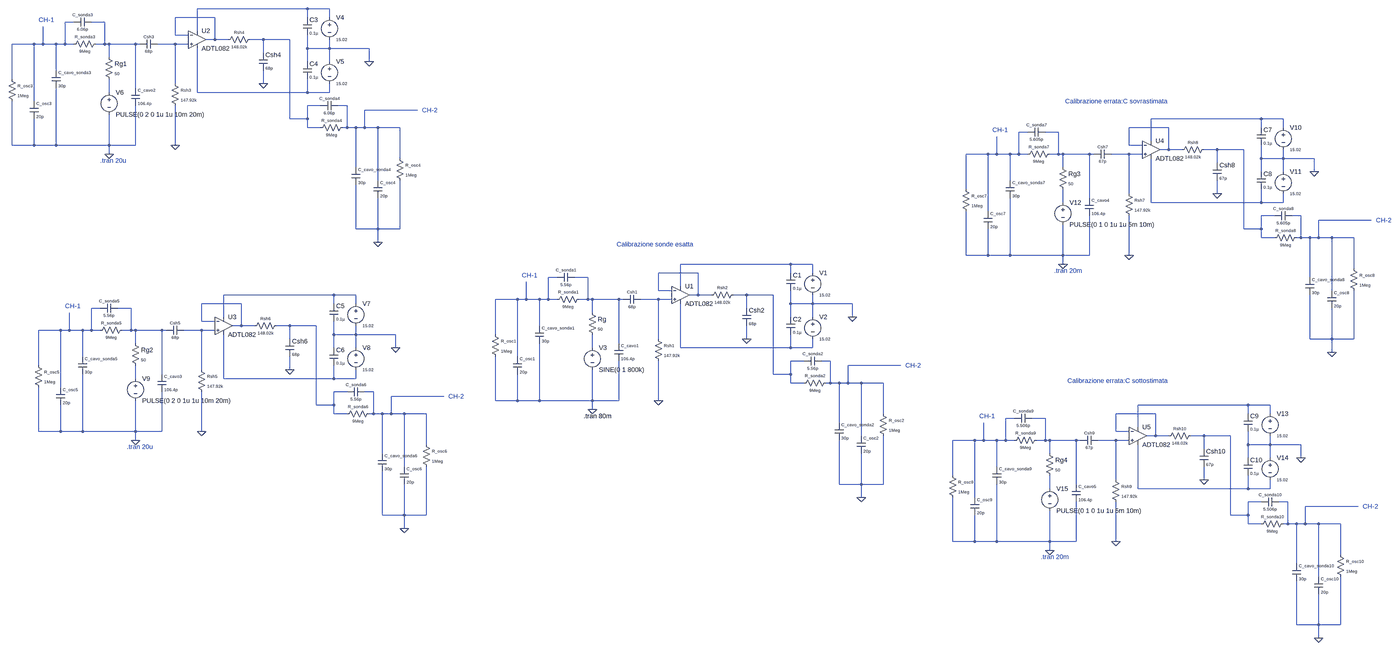
[diagram p0: schematic Shaper_Basic.asc, whole sheet]
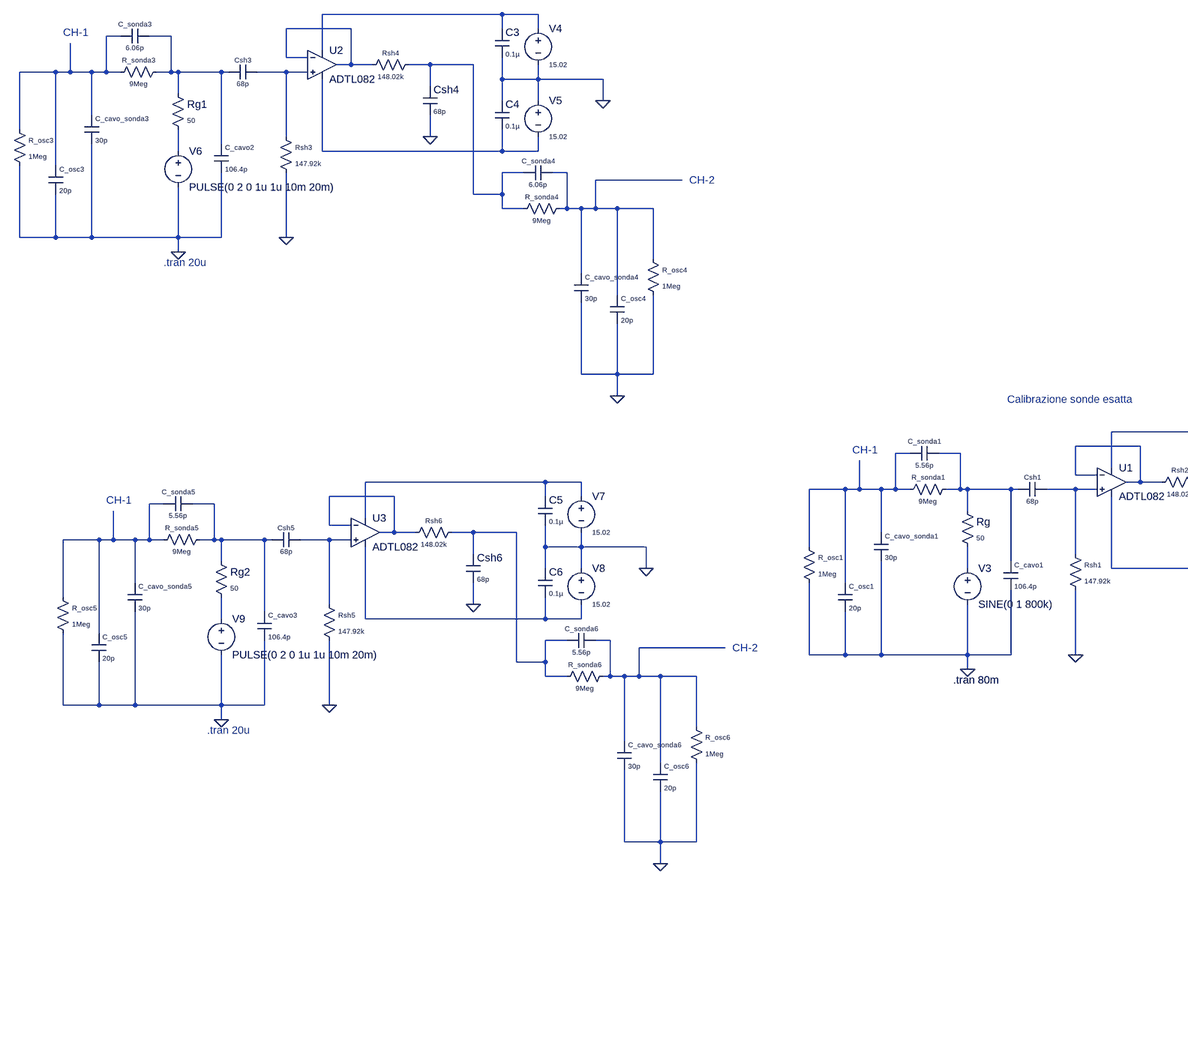
[diagram p1: schematic Shaper_Basic.asc, part, row 1 of 1, column 1 of 2]
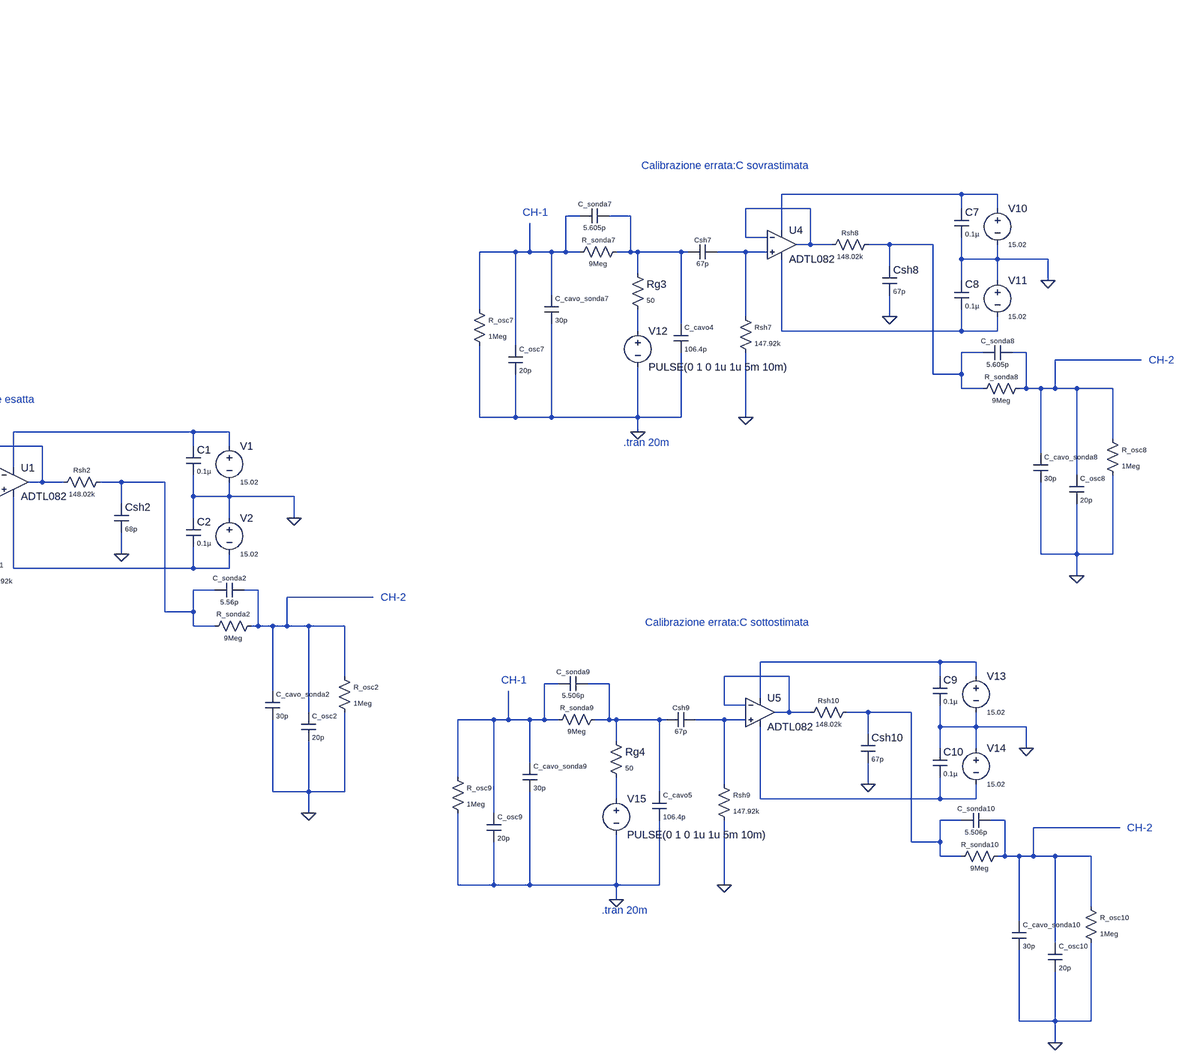
[diagram p2: schematic Shaper_Basic.asc, part, row 1 of 1, column 2 of 2]
Shaper_Basic.asc, the LTspice schematic file:
Version 4.1
SHEET 1 4492 1780
WIRE -1712 -1024 -2112 -1024
WIRE -1632 -1024 -1712 -1024
WIRE -2048 -992 -2192 -992
WIRE -1712 -992 -1712 -1024
WIRE -1632 -992 -1632 -1024
WIRE -2560 -976 -2592 -976
WIRE -2448 -976 -2496 -976
WIRE -2112 -944 -2112 -1024
WIRE -2192 -928 -2192 -992
WIRE -2144 -928 -2192 -928
WIRE -2048 -912 -2048 -992
WIRE -2048 -912 -2080 -912
WIRE -2000 -912 -2048 -912
WIRE -1872 -912 -1920 -912
WIRE -1776 -912 -1872 -912
WIRE -2704 -896 -2784 -896
WIRE -2672 -896 -2672 -960
WIRE -2672 -896 -2704 -896
WIRE -2624 -896 -2672 -896
WIRE -2592 -896 -2592 -976
WIRE -2592 -896 -2624 -896
WIRE -2560 -896 -2592 -896
WIRE -2448 -896 -2448 -976
WIRE -2448 -896 -2480 -896
WIRE -2432 -896 -2448 -896
WIRE -2336 -896 -2432 -896
WIRE -2320 -896 -2336 -896
WIRE -2192 -896 -2256 -896
WIRE -2144 -896 -2192 -896
WIRE -1712 -880 -1712 -928
WIRE -1632 -880 -1632 -912
WIRE -1632 -880 -1712 -880
WIRE -1488 -880 -1632 -880
WIRE -1872 -864 -1872 -912
WIRE -2432 -848 -2432 -896
WIRE -1712 -832 -1712 -880
WIRE -1632 -832 -1632 -880
WIRE -1488 -832 -1488 -880
WIRE -2624 -800 -2624 -896
WIRE -2784 -768 -2784 -896
WIRE -2192 -752 -2192 -896
WIRE -1872 -752 -1872 -800
WIRE -2336 -736 -2336 -896
WIRE -2432 -720 -2432 -768
WIRE -2112 -720 -2112 -880
WIRE -1712 -720 -1712 -768
WIRE -1712 -720 -2112 -720
WIRE -1632 -720 -1632 -752
WIRE -1632 -720 -1712 -720
WIRE -2704 -688 -2704 -896
WIRE -1664 -672 -1712 -672
WIRE -1568 -672 -1600 -672
WIRE -1312 -656 -1504 -656
WIRE -1776 -624 -1776 -912
WIRE -1712 -624 -1712 -672
WIRE -1712 -624 -1776 -624
WIRE 2336 -624 1936 -624
WIRE 2416 -624 2336 -624
WIRE -1712 -592 -1712 -624
WIRE -1664 -592 -1712 -592
WIRE -1568 -592 -1568 -672
WIRE -1568 -592 -1584 -592
WIRE -1536 -592 -1568 -592
WIRE -1504 -592 -1504 -656
WIRE -1504 -592 -1536 -592
WIRE -1456 -592 -1504 -592
WIRE -1376 -592 -1456 -592
WIRE 2000 -592 1856 -592
WIRE 2336 -592 2336 -624
WIRE 2416 -592 2416 -624
WIRE 1488 -576 1456 -576
WIRE 1600 -576 1552 -576
WIRE 1936 -544 1936 -624
WIRE -2784 -528 -2784 -688
WIRE -2704 -528 -2704 -624
WIRE -2704 -528 -2784 -528
WIRE -2624 -528 -2624 -736
WIRE -2624 -528 -2704 -528
WIRE -2432 -528 -2432 -640
WIRE -2432 -528 -2624 -528
WIRE -2336 -528 -2336 -672
WIRE -2336 -528 -2432 -528
WIRE -2192 -528 -2192 -672
WIRE 1856 -528 1856 -592
WIRE 1904 -528 1856 -528
WIRE 2000 -512 2000 -592
WIRE 2000 -512 1968 -512
WIRE 2048 -512 2000 -512
WIRE 2176 -512 2128 -512
WIRE 2272 -512 2176 -512
WIRE -2432 -496 -2432 -528
WIRE 1344 -496 1264 -496
WIRE 1376 -496 1376 -560
WIRE 1376 -496 1344 -496
WIRE 1424 -496 1376 -496
WIRE 1456 -496 1456 -576
WIRE 1456 -496 1424 -496
WIRE 1488 -496 1456 -496
WIRE 1600 -496 1600 -576
WIRE 1600 -496 1568 -496
WIRE 1616 -496 1600 -496
WIRE 1712 -496 1616 -496
WIRE 1728 -496 1712 -496
WIRE 1856 -496 1792 -496
WIRE 1904 -496 1856 -496
WIRE -1376 -480 -1376 -592
WIRE 2336 -480 2336 -528
WIRE 2416 -480 2416 -512
WIRE 2416 -480 2336 -480
WIRE 2528 -480 2416 -480
WIRE 2176 -464 2176 -512
WIRE -1536 -448 -1536 -592
WIRE 1616 -448 1616 -496
WIRE 2336 -432 2336 -480
WIRE 2416 -432 2416 -480
WIRE 2528 -432 2528 -480
WIRE -1456 -400 -1456 -592
WIRE 1424 -400 1424 -496
WIRE 1264 -368 1264 -496
WIRE 1856 -352 1856 -496
WIRE 2176 -352 2176 -400
WIRE 1712 -336 1712 -496
WIRE 1616 -320 1616 -368
WIRE 1936 -320 1936 -480
WIRE 2336 -320 2336 -368
WIRE 2336 -320 1936 -320
WIRE 2416 -320 2416 -352
WIRE 2416 -320 2336 -320
WIRE 1344 -288 1344 -496
WIRE 2384 -272 2336 -272
WIRE 2480 -272 2448 -272
WIRE 2736 -256 2544 -256
WIRE -1536 -224 -1536 -384
WIRE -1456 -224 -1456 -336
WIRE -1456 -224 -1536 -224
WIRE -1376 -224 -1376 -400
WIRE -1376 -224 -1456 -224
WIRE 2272 -224 2272 -512
WIRE 2336 -224 2336 -272
WIRE 2336 -224 2272 -224
WIRE 2336 -192 2336 -224
WIRE 2384 -192 2336 -192
WIRE 2480 -192 2480 -272
WIRE 2480 -192 2464 -192
WIRE 2512 -192 2480 -192
WIRE 2544 -192 2544 -256
WIRE 2544 -192 2512 -192
WIRE 2592 -192 2544 -192
WIRE 2672 -192 2592 -192
WIRE -1456 -176 -1456 -224
WIRE 1264 -128 1264 -288
WIRE 1344 -128 1344 -224
WIRE 1344 -128 1264 -128
WIRE 1424 -128 1424 -336
WIRE 1424 -128 1344 -128
WIRE 1616 -128 1616 -240
WIRE 1616 -128 1424 -128
WIRE 1712 -128 1712 -272
WIRE 1712 -128 1616 -128
WIRE 1856 -128 1856 -272
WIRE 416 -96 16 -96
WIRE 496 -96 416 -96
WIRE 1616 -96 1616 -128
WIRE 2672 -80 2672 -192
WIRE 80 -64 -64 -64
WIRE 416 -64 416 -96
WIRE 496 -64 496 -96
WIRE -432 -48 -464 -48
WIRE -320 -48 -368 -48
WIRE 2512 -48 2512 -192
WIRE 16 -16 16 -96
WIRE -64 0 -64 -64
WIRE -16 0 -64 0
WIRE 2592 0 2592 -192
WIRE -1616 16 -2016 16
WIRE -1536 16 -1616 16
WIRE 80 16 80 -64
WIRE 80 16 48 16
WIRE 128 16 80 16
WIRE 256 16 208 16
WIRE 352 16 256 16
WIRE -576 32 -656 32
WIRE -544 32 -544 -32
WIRE -544 32 -576 32
WIRE -496 32 -544 32
WIRE -464 32 -464 -48
WIRE -464 32 -496 32
WIRE -432 32 -464 32
WIRE -320 32 -320 -48
WIRE -320 32 -352 32
WIRE -304 32 -320 32
WIRE -208 32 -304 32
WIRE -192 32 -208 32
WIRE -64 32 -128 32
WIRE -16 32 -64 32
WIRE -1952 48 -2096 48
WIRE -1616 48 -1616 16
WIRE -1536 48 -1536 16
WIRE 416 48 416 0
WIRE 496 48 496 16
WIRE 496 48 416 48
WIRE 640 48 496 48
WIRE -2464 64 -2496 64
WIRE -2352 64 -2400 64
WIRE 256 64 256 16
WIRE -304 80 -304 32
WIRE -2016 96 -2016 16
WIRE 416 96 416 48
WIRE 496 96 496 48
WIRE 640 96 640 48
WIRE -2096 112 -2096 48
WIRE -2048 112 -2096 112
WIRE -1952 128 -1952 48
WIRE -1952 128 -1984 128
WIRE -1904 128 -1952 128
WIRE -1776 128 -1824 128
WIRE -1680 128 -1776 128
WIRE -496 128 -496 32
WIRE -2608 144 -2688 144
WIRE -2576 144 -2576 80
WIRE -2576 144 -2608 144
WIRE -2528 144 -2576 144
WIRE -2496 144 -2496 64
WIRE -2496 144 -2528 144
WIRE -2464 144 -2496 144
WIRE -2352 144 -2352 64
WIRE -2352 144 -2384 144
WIRE -2336 144 -2352 144
WIRE -2240 144 -2336 144
WIRE -2224 144 -2240 144
WIRE -2096 144 -2160 144
WIRE -2048 144 -2096 144
WIRE -1616 160 -1616 112
WIRE -1536 160 -1536 128
WIRE -1536 160 -1616 160
WIRE -1392 160 -1536 160
WIRE -656 160 -656 32
WIRE -1776 176 -1776 128
WIRE -64 176 -64 32
WIRE 256 176 256 128
WIRE 2512 176 2512 16
WIRE 2592 176 2592 64
WIRE 2592 176 2512 176
WIRE 2672 176 2672 0
WIRE 2672 176 2592 176
WIRE -2336 192 -2336 144
WIRE -208 192 -208 32
WIRE -1616 208 -1616 160
WIRE -1536 208 -1536 160
WIRE -1392 208 -1392 160
WIRE -304 208 -304 160
WIRE 16 208 16 48
WIRE 416 208 416 160
WIRE 416 208 16 208
WIRE 496 208 496 176
WIRE 496 208 416 208
WIRE 2592 224 2592 176
WIRE -2528 240 -2528 144
WIRE -576 240 -576 32
WIRE 464 256 416 256
WIRE 560 256 528 256
WIRE -2688 272 -2688 144
WIRE 816 272 624 272
WIRE -2096 288 -2096 144
WIRE -1776 288 -1776 240
WIRE -2240 304 -2240 144
WIRE 352 304 352 16
WIRE 416 304 416 256
WIRE 416 304 352 304
WIRE -2336 320 -2336 272
WIRE -2016 320 -2016 160
WIRE -1616 320 -1616 272
WIRE -1616 320 -2016 320
WIRE -1536 320 -1536 288
WIRE -1536 320 -1616 320
WIRE 416 336 416 304
WIRE 464 336 416 336
WIRE 560 336 560 256
WIRE 560 336 544 336
WIRE 592 336 560 336
WIRE 624 336 624 272
WIRE 624 336 592 336
WIRE 672 336 624 336
WIRE 752 336 672 336
WIRE -2608 352 -2608 144
WIRE -1568 368 -1616 368
WIRE -1472 368 -1504 368
WIRE -1216 384 -1408 384
WIRE -656 400 -656 240
WIRE -576 400 -576 304
WIRE -576 400 -656 400
WIRE -496 400 -496 192
WIRE -496 400 -576 400
WIRE -304 400 -304 288
WIRE -304 400 -496 400
WIRE -208 400 -208 256
WIRE -208 400 -304 400
WIRE -64 400 -64 256
WIRE -1680 416 -1680 128
WIRE -1616 416 -1616 368
WIRE -1616 416 -1680 416
WIRE 2288 416 1888 416
WIRE 2368 416 2288 416
WIRE -304 432 -304 400
WIRE -1616 448 -1616 416
WIRE -1568 448 -1616 448
WIRE -1472 448 -1472 368
WIRE -1472 448 -1488 448
WIRE -1440 448 -1472 448
WIRE -1408 448 -1408 384
WIRE -1408 448 -1440 448
WIRE -1360 448 -1408 448
WIRE -1280 448 -1360 448
WIRE 752 448 752 336
WIRE 1952 448 1808 448
WIRE 2288 448 2288 416
WIRE 2368 448 2368 416
WIRE 1440 464 1408 464
WIRE 1552 464 1504 464
WIRE 592 480 592 336
WIRE 1888 496 1888 416
WIRE -2688 512 -2688 352
WIRE -2608 512 -2608 416
WIRE -2608 512 -2688 512
WIRE -2528 512 -2528 304
WIRE -2528 512 -2608 512
WIRE -2336 512 -2336 400
WIRE -2336 512 -2528 512
WIRE -2240 512 -2240 368
WIRE -2240 512 -2336 512
WIRE -2096 512 -2096 368
WIRE 1808 512 1808 448
WIRE 1856 512 1808 512
WIRE 672 528 672 336
WIRE 1952 528 1952 448
WIRE 1952 528 1920 528
WIRE 2000 528 1952 528
WIRE 2128 528 2080 528
WIRE 2224 528 2128 528
WIRE -2336 544 -2336 512
WIRE 1296 544 1216 544
WIRE 1328 544 1328 480
WIRE 1328 544 1296 544
WIRE 1376 544 1328 544
WIRE 1408 544 1408 464
WIRE 1408 544 1376 544
WIRE 1440 544 1408 544
WIRE 1552 544 1552 464
WIRE 1552 544 1520 544
WIRE 1568 544 1552 544
WIRE 1664 544 1568 544
WIRE 1680 544 1664 544
WIRE 1808 544 1744 544
WIRE 1856 544 1808 544
WIRE -1280 560 -1280 448
WIRE 2288 560 2288 512
WIRE 2368 560 2368 528
WIRE 2368 560 2288 560
WIRE 2480 560 2368 560
WIRE 2128 576 2128 528
WIRE -1440 592 -1440 448
WIRE 1568 592 1568 544
WIRE 2288 608 2288 560
WIRE 2368 608 2368 560
WIRE 2480 608 2480 560
WIRE -1360 640 -1360 448
WIRE 1376 640 1376 544
WIRE 1216 672 1216 544
WIRE 1808 688 1808 544
WIRE 2128 688 2128 640
WIRE 592 704 592 544
WIRE 672 704 672 592
WIRE 672 704 592 704
WIRE 752 704 752 528
WIRE 752 704 672 704
WIRE 1664 704 1664 544
WIRE 1568 720 1568 672
WIRE 1888 720 1888 560
WIRE 2288 720 2288 672
WIRE 2288 720 1888 720
WIRE 2368 720 2368 688
WIRE 2368 720 2288 720
WIRE 672 752 672 704
WIRE 1296 752 1296 544
WIRE 2336 768 2288 768
WIRE 2432 768 2400 768
WIRE 2688 784 2496 784
WIRE -1440 816 -1440 656
WIRE -1360 816 -1360 704
WIRE -1360 816 -1440 816
WIRE -1280 816 -1280 640
WIRE -1280 816 -1360 816
WIRE 2224 816 2224 528
WIRE 2288 816 2288 768
WIRE 2288 816 2224 816
WIRE 2288 848 2288 816
WIRE 2336 848 2288 848
WIRE 2432 848 2432 768
WIRE 2432 848 2416 848
WIRE 2464 848 2432 848
WIRE 2496 848 2496 784
WIRE 2496 848 2464 848
WIRE 2544 848 2496 848
WIRE 2624 848 2544 848
WIRE -1360 864 -1360 816
WIRE 1216 912 1216 752
WIRE 1296 912 1296 816
WIRE 1296 912 1216 912
WIRE 1376 912 1376 704
WIRE 1376 912 1296 912
WIRE 1568 912 1568 800
WIRE 1568 912 1376 912
WIRE 1664 912 1664 768
WIRE 1664 912 1568 912
WIRE 1808 912 1808 768
WIRE 1568 944 1568 912
WIRE 2624 960 2624 848
WIRE 2464 992 2464 848
WIRE 2544 1040 2544 848
WIRE 2464 1216 2464 1056
WIRE 2544 1216 2544 1104
WIRE 2544 1216 2464 1216
WIRE 2624 1216 2624 1040
WIRE 2624 1216 2544 1216
WIRE 2544 1264 2544 1216
FLAG -304 432 0
FLAG 672 752 0
FLAG -64 400 0
FLAG 640 96 0
FLAG 256 176 0
FLAG 1616 -96 0
FLAG 2592 224 0
FLAG 1856 -128 0
FLAG 2528 -432 0
FLAG 2176 -352 0
FLAG 1568 944 0
FLAG 2544 1264 0
FLAG 1808 912 0
FLAG 2480 608 0
FLAG 2128 688 0
FLAG -2432 -496 0
FLAG -1456 -176 0
FLAG -2192 -528 0
FLAG -1488 -832 0
FLAG -1872 -752 0
FLAG -2336 544 0
FLAG -1360 864 0
FLAG -2096 512 0
FLAG -1392 208 0
FLAG -1776 288 0
SYMBOL OpAmps\\ADTL082 16 -48 R0
SYMATTR InstName U1
SYMBOL voltage 496 -80 R0
WINDOW 3 24 96 Left 1
WINDOW 123 0 0 Left 0
WINDOW 39 0 0 Left 0
SYMATTR Value 15.02
SYMATTR InstName V1
SYMBOL voltage 496 80 R0
WINDOW 3 24 96 Left 1
WINDOW 123 0 0 Left 0
WINDOW 39 0 0 Left 0
SYMATTR Value 15.02
SYMATTR InstName V2
SYMBOL cap 400 -64 R0
WINDOW 3 24 56 Left 1
SYMATTR Value 0.1µ
SYMATTR InstName C1
SYMBOL cap 400 96 R0
WINDOW 3 24 56 Left 1
SYMATTR Value 0.1µ
SYMATTR InstName C2
SYMBOL voltage -304 192 R0
WINDOW 123 0 0 Left 0
WINDOW 39 0 0 Left 0
SYMATTR InstName V3
SYMATTR Value SINE(0 1 800k)
SYMBOL res -320 64 R0
WINDOW 3 36 76 Left 1
SYMATTR Value 50
SYMATTR InstName Rg
SYMBOL res -336 16 R90
WINDOW 0 0 56 VBottom 1
WINDOW 3 32 56 VTop 1
SYMATTR InstName R_sonda1
SYMATTR Value 9Meg
SYMBOL cap -368 -64 R90
WINDOW 0 0 32 VBottom 1
WINDOW 3 32 32 VTop 1
SYMATTR InstName C_sonda1
SYMATTR Value 5.56p
SYMBOL res -672 144 R0
WINDOW 0 36 40 Left 1
WINDOW 3 36 76 Left 1
SYMATTR InstName R_osc1
SYMATTR Value 1Meg
SYMBOL cap -592 240 R0
WINDOW 0 24 8 Left 1
WINDOW 3 24 56 Left 1
SYMATTR InstName C_osc1
SYMATTR Value 20p
SYMBOL cap -512 128 R0
WINDOW 0 24 8 Left 1
WINDOW 3 24 56 Left 1
SYMATTR InstName C_cavo_sonda1
SYMATTR Value 30p
SYMBOL res 560 320 R90
WINDOW 0 0 56 VBottom 1
WINDOW 3 32 56 VTop 1
SYMATTR InstName R_sonda2
SYMATTR Value 9Meg
SYMBOL cap 528 240 R90
WINDOW 0 0 32 VBottom 1
WINDOW 3 32 32 VTop 1
SYMATTR InstName C_sonda2
SYMATTR Value 5.56p
SYMBOL cap 576 480 R0
WINDOW 0 24 8 Left 1
WINDOW 3 24 56 Left 1
SYMATTR InstName C_cavo_sonda2
SYMATTR Value 30p
SYMBOL cap 656 528 R0
WINDOW 0 24 8 Left 1
WINDOW 3 24 56 Left 1
SYMATTR InstName C_osc2
SYMATTR Value 20p
SYMBOL res 736 432 R0
WINDOW 0 36 40 Left 1
WINDOW 3 36 76 Left 1
SYMATTR InstName R_osc2
SYMATTR Value 1Meg
SYMBOL cap -224 256 M180
WINDOW 0 24 56 Left 1
WINDOW 3 24 8 Left 1
SYMATTR InstName C_cavo1
SYMATTR Value 106.4p
SYMBOL res -80 160 R0
WINDOW 0 36 40 Left 1
WINDOW 3 36 76 Left 1
SYMATTR InstName Rsh1
SYMATTR Value 147.92k
SYMBOL cap -128 16 R90
WINDOW 0 0 32 VBottom 1
WINDOW 3 32 32 VTop 1
SYMATTR InstName Csh1
SYMATTR Value 68p
SYMBOL res 224 0 R90
WINDOW 0 0 56 VBottom 1
WINDOW 3 32 56 VTop 1
SYMATTR InstName Rsh2
SYMATTR Value 148.02k
SYMBOL cap 240 64 R0
WINDOW 3 24 56 Left 1
SYMATTR Value 68p
SYMATTR InstName Csh2
SYMBOL OpAmps\\ADTL082 1936 -576 R0
SYMATTR InstName U4
SYMBOL voltage 2416 -608 R0
WINDOW 3 24 96 Left 1
WINDOW 123 0 0 Left 0
WINDOW 39 0 0 Left 0
SYMATTR Value 15.02
SYMATTR InstName V10
SYMBOL voltage 2416 -448 R0
WINDOW 3 24 96 Left 1
WINDOW 123 0 0 Left 0
WINDOW 39 0 0 Left 0
SYMATTR Value 15.02
SYMATTR InstName V11
SYMBOL cap 2320 -592 R0
WINDOW 3 24 56 Left 1
SYMATTR Value 0.1µ
SYMATTR InstName C7
SYMBOL cap 2320 -432 R0
WINDOW 3 24 56 Left 1
SYMATTR Value 0.1µ
SYMATTR InstName C8
SYMBOL voltage 1616 -336 R0
WINDOW 123 0 0 Left 0
WINDOW 39 0 0 Left 0
SYMATTR InstName V12
SYMATTR Value PULSE(0 1 0 1u 1u 5m 10m)
SYMBOL res 1600 -464 R0
WINDOW 3 36 76 Left 1
SYMATTR Value 50
SYMATTR InstName Rg3
SYMBOL res 1584 -512 R90
WINDOW 0 0 56 VBottom 1
WINDOW 3 32 56 VTop 1
SYMATTR InstName R_sonda7
SYMATTR Value 9Meg
SYMBOL cap 1552 -592 R90
WINDOW 0 0 32 VBottom 1
WINDOW 3 32 32 VTop 1
SYMATTR InstName C_sonda7
SYMATTR Value 5.605p
SYMBOL res 1248 -384 R0
WINDOW 0 36 40 Left 1
WINDOW 3 36 76 Left 1
SYMATTR InstName R_osc7
SYMATTR Value 1Meg
SYMBOL cap 1328 -288 R0
WINDOW 0 24 8 Left 1
WINDOW 3 24 56 Left 1
SYMATTR InstName C_osc7
SYMATTR Value 20p
SYMBOL cap 1408 -400 R0
WINDOW 0 24 8 Left 1
WINDOW 3 24 56 Left 1
SYMATTR InstName C_cavo_sonda7
SYMATTR Value 30p
SYMBOL res 2480 -208 R90
WINDOW 0 0 56 VBottom 1
WINDOW 3 32 56 VTop 1
SYMATTR InstName R_sonda8
SYMATTR Value 9Meg
SYMBOL cap 2448 -288 R90
WINDOW 0 0 32 VBottom 1
WINDOW 3 32 32 VTop 1
SYMATTR InstName C_sonda8
SYMATTR Value 5.605p
SYMBOL cap 2496 -48 R0
WINDOW 0 24 8 Left 1
WINDOW 3 24 56 Left 1
SYMATTR InstName C_cavo_sonda8
SYMATTR Value 30p
SYMBOL cap 2576 0 R0
WINDOW 0 24 8 Left 1
WINDOW 3 24 56 Left 1
SYMATTR InstName C_osc8
SYMATTR Value 20p
SYMBOL res 2656 -96 R0
WINDOW 0 36 40 Left 1
WINDOW 3 36 76 Left 1
SYMATTR InstName R_osc8
SYMATTR Value 1Meg
SYMBOL cap 1696 -272 M180
WINDOW 0 24 56 Left 1
WINDOW 3 24 8 Left 1
SYMATTR InstName C_cavo4
SYMATTR Value 106.4p
SYMBOL res 1840 -368 R0
WINDOW 0 36 40 Left 1
WINDOW 3 36 76 Left 1
SYMATTR InstName Rsh7
SYMATTR Value 147.92k
SYMBOL cap 1792 -512 R90
WINDOW 0 0 32 VBottom 1
WINDOW 3 32 32 VTop 1
SYMATTR InstName Csh7
SYMATTR Value 67p
SYMBOL res 2144 -528 R90
WINDOW 0 0 56 VBottom 1
WINDOW 3 32 56 VTop 1
SYMATTR InstName Rsh8
SYMATTR Value 148.02k
SYMBOL cap 2160 -464 R0
WINDOW 3 24 56 Left 1
SYMATTR Value 67p
SYMATTR InstName Csh8
SYMBOL OpAmps\\ADTL082 1888 464 R0
SYMATTR InstName U5
SYMBOL voltage 2368 432 R0
WINDOW 3 24 96 Left 1
WINDOW 123 0 0 Left 0
WINDOW 39 0 0 Left 0
SYMATTR Value 15.02
SYMATTR InstName V13
SYMBOL voltage 2368 592 R0
WINDOW 3 24 96 Left 1
WINDOW 123 0 0 Left 0
WINDOW 39 0 0 Left 0
SYMATTR Value 15.02
SYMATTR InstName V14
SYMBOL cap 2272 448 R0
WINDOW 3 24 56 Left 1
SYMATTR Value 0.1µ
SYMATTR InstName C9
SYMBOL cap 2272 608 R0
WINDOW 3 24 56 Left 1
SYMATTR Value 0.1µ
SYMATTR InstName C10
SYMBOL voltage 1568 704 R0
WINDOW 123 0 0 Left 0
WINDOW 39 0 0 Left 0
SYMATTR InstName V15
SYMATTR Value PULSE(0 1 0 1u 1u 5m 10m)
SYMBOL res 1552 576 R0
WINDOW 3 36 76 Left 1
SYMATTR Value 50
SYMATTR InstName Rg4
SYMBOL res 1536 528 R90
WINDOW 0 0 56 VBottom 1
WINDOW 3 32 56 VTop 1
SYMATTR InstName R_sonda9
SYMATTR Value 9Meg
SYMBOL cap 1504 448 R90
WINDOW 0 0 32 VBottom 1
WINDOW 3 32 32 VTop 1
SYMATTR InstName C_sonda9
SYMATTR Value 5.506p
SYMBOL res 1200 656 R0
WINDOW 0 36 40 Left 1
WINDOW 3 36 76 Left 1
SYMATTR InstName R_osc9
SYMATTR Value 1Meg
SYMBOL cap 1280 752 R0
WINDOW 0 24 8 Left 1
WINDOW 3 24 56 Left 1
SYMATTR InstName C_osc9
SYMATTR Value 20p
SYMBOL cap 1360 640 R0
WINDOW 0 24 8 Left 1
WINDOW 3 24 56 Left 1
SYMATTR InstName C_cavo_sonda9
SYMATTR Value 30p
SYMBOL res 2432 832 R90
WINDOW 0 0 56 VBottom 1
WINDOW 3 32 56 VTop 1
SYMATTR InstName R_sonda10
SYMATTR Value 9Meg
SYMBOL cap 2400 752 R90
WINDOW 0 0 32 VBottom 1
WINDOW 3 32 32 VTop 1
SYMATTR InstName C_sonda10
SYMATTR Value 5.506p
SYMBOL cap 2448 992 R0
WINDOW 0 24 8 Left 1
WINDOW 3 24 56 Left 1
SYMATTR InstName C_cavo_sonda10
SYMATTR Value 30p
SYMBOL cap 2528 1040 R0
WINDOW 0 24 8 Left 1
WINDOW 3 24 56 Left 1
SYMATTR InstName C_osc10
SYMATTR Value 20p
SYMBOL res 2608 944 R0
WINDOW 0 36 40 Left 1
WINDOW 3 36 76 Left 1
SYMATTR InstName R_osc10
SYMATTR Value 1Meg
SYMBOL cap 1648 768 M180
WINDOW 0 24 56 Left 1
WINDOW 3 24 8 Left 1
SYMATTR InstName C_cavo5
SYMATTR Value 106.4p
SYMBOL res 1792 672 R0
WINDOW 0 36 40 Left 1
WINDOW 3 36 76 Left 1
SYMATTR InstName Rsh9
SYMATTR Value 147.92k
SYMBOL cap 1744 528 R90
WINDOW 0 0 32 VBottom 1
WINDOW 3 32 32 VTop 1
SYMATTR InstName Csh9
SYMATTR Value 67p
SYMBOL res 2096 512 R90
WINDOW 0 0 56 VBottom 1
WINDOW 3 32 56 VTop 1
SYMATTR InstName Rsh10
SYMATTR Value 148.02k
SYMBOL cap 2112 576 R0
WINDOW 3 24 56 Left 1
SYMATTR Value 67p
SYMATTR InstName Csh10
SYMBOL OpAmps\\ADTL082 -2112 -976 R0
SYMATTR InstName U2
SYMBOL voltage -1632 -1008 R0
WINDOW 3 24 96 Left 1
WINDOW 123 0 0 Left 0
WINDOW 39 0 0 Left 0
SYMATTR Value 15.02
SYMATTR InstName V4
SYMBOL voltage -1632 -848 R0
WINDOW 3 24 96 Left 1
WINDOW 123 0 0 Left 0
WINDOW 39 0 0 Left 0
SYMATTR Value 15.02
SYMATTR InstName V5
SYMBOL cap -1728 -992 R0
WINDOW 3 24 56 Left 1
SYMATTR Value 0.1µ
SYMATTR InstName C3
SYMBOL cap -1728 -832 R0
WINDOW 3 24 56 Left 1
SYMATTR Value 0.1µ
SYMATTR InstName C4
SYMBOL voltage -2432 -736 R0
WINDOW 123 0 0 Left 0
WINDOW 39 0 0 Left 0
SYMATTR InstName V6
SYMATTR Value PULSE(0 2 0 1u 1u 10m 20m)
SYMBOL res -2448 -864 R0
WINDOW 3 36 76 Left 1
SYMATTR Value 50
SYMATTR InstName Rg1
SYMBOL res -2464 -912 R90
WINDOW 0 0 56 VBottom 1
WINDOW 3 32 56 VTop 1
SYMATTR InstName R_sonda3
SYMATTR Value 9Meg
SYMBOL cap -2496 -992 R90
WINDOW 0 0 32 VBottom 1
WINDOW 3 32 32 VTop 1
SYMATTR InstName C_sonda3
SYMATTR Value 6.06p
SYMBOL res -2800 -784 R0
WINDOW 0 36 40 Left 1
WINDOW 3 36 76 Left 1
SYMATTR InstName R_osc3
SYMATTR Value 1Meg
SYMBOL cap -2720 -688 R0
WINDOW 0 24 8 Left 1
WINDOW 3 24 56 Left 1
SYMATTR InstName C_osc3
SYMATTR Value 20p
SYMBOL cap -2640 -800 R0
WINDOW 0 24 8 Left 1
WINDOW 3 24 56 Left 1
SYMATTR InstName C_cavo_sonda3
SYMATTR Value 30p
SYMBOL res -1568 -608 R90
WINDOW 0 0 56 VBottom 1
WINDOW 3 32 56 VTop 1
SYMATTR InstName R_sonda4
SYMATTR Value 9Meg
SYMBOL cap -1600 -688 R90
WINDOW 0 0 32 VBottom 1
WINDOW 3 32 32 VTop 1
SYMATTR InstName C_sonda4
SYMATTR Value 6.06p
SYMBOL cap -1552 -448 R0
WINDOW 0 24 8 Left 1
WINDOW 3 24 56 Left 1
SYMATTR InstName C_cavo_sonda4
SYMATTR Value 30p
SYMBOL cap -1472 -400 R0
WINDOW 0 24 8 Left 1
WINDOW 3 24 56 Left 1
SYMATTR InstName C_osc4
SYMATTR Value 20p
SYMBOL res -1392 -496 R0
WINDOW 0 36 40 Left 1
WINDOW 3 36 76 Left 1
SYMATTR InstName R_osc4
SYMATTR Value 1Meg
SYMBOL cap -2352 -672 M180
WINDOW 0 24 56 Left 1
WINDOW 3 24 8 Left 1
SYMATTR InstName C_cavo2
SYMATTR Value 106.4p
SYMBOL res -2208 -768 R0
WINDOW 0 36 40 Left 1
WINDOW 3 36 76 Left 1
SYMATTR InstName Rsh3
SYMATTR Value 147.92k
SYMBOL cap -2256 -912 R90
WINDOW 0 0 32 VBottom 1
WINDOW 3 32 32 VTop 1
SYMATTR InstName Csh3
SYMATTR Value 68p
SYMBOL res -1904 -928 R90
WINDOW 0 0 56 VBottom 1
WINDOW 3 32 56 VTop 1
SYMATTR InstName Rsh4
SYMATTR Value 148.02k
SYMBOL cap -1888 -864 R0
WINDOW 3 24 56 Left 1
SYMATTR Value 68p
SYMATTR InstName Csh4
SYMBOL OpAmps\\ADTL082 -2016 64 R0
SYMATTR InstName U3
SYMBOL voltage -1536 32 R0
WINDOW 3 24 96 Left 1
WINDOW 123 0 0 Left 0
WINDOW 39 0 0 Left 0
SYMATTR Value 15.02
SYMATTR InstName V7
SYMBOL voltage -1536 192 R0
WINDOW 3 24 96 Left 1
WINDOW 123 0 0 Left 0
WINDOW 39 0 0 Left 0
SYMATTR Value 15.02
SYMATTR InstName V8
SYMBOL cap -1632 48 R0
WINDOW 3 24 56 Left 1
SYMATTR Value 0.1µ
SYMATTR InstName C5
SYMBOL cap -1632 208 R0
WINDOW 3 24 56 Left 1
SYMATTR Value 0.1µ
SYMATTR InstName C6
SYMBOL voltage -2336 304 R0
WINDOW 123 0 0 Left 0
WINDOW 39 0 0 Left 0
SYMATTR InstName V9
SYMATTR Value PULSE(0 2 0 1u 1u 10m 20m)
SYMBOL res -2352 176 R0
WINDOW 3 36 76 Left 1
SYMATTR Value 50
SYMATTR InstName Rg2
SYMBOL res -2368 128 R90
WINDOW 0 0 56 VBottom 1
WINDOW 3 32 56 VTop 1
SYMATTR InstName R_sonda5
SYMATTR Value 9Meg
SYMBOL cap -2400 48 R90
WINDOW 0 0 32 VBottom 1
WINDOW 3 32 32 VTop 1
SYMATTR InstName C_sonda5
SYMATTR Value 5.56p
SYMBOL res -2704 256 R0
WINDOW 0 36 40 Left 1
WINDOW 3 36 76 Left 1
SYMATTR InstName R_osc5
SYMATTR Value 1Meg
SYMBOL cap -2624 352 R0
WINDOW 0 24 8 Left 1
WINDOW 3 24 56 Left 1
SYMATTR InstName C_osc5
SYMATTR Value 20p
SYMBOL cap -2544 240 R0
WINDOW 0 24 8 Left 1
WINDOW 3 24 56 Left 1
SYMATTR InstName C_cavo_sonda5
SYMATTR Value 30p
SYMBOL res -1472 432 R90
WINDOW 0 0 56 VBottom 1
WINDOW 3 32 56 VTop 1
SYMATTR InstName R_sonda6
SYMATTR Value 9Meg
SYMBOL cap -1504 352 R90
WINDOW 0 0 32 VBottom 1
WINDOW 3 32 32 VTop 1
SYMATTR InstName C_sonda6
SYMATTR Value 5.56p
SYMBOL cap -1456 592 R0
WINDOW 0 24 8 Left 1
WINDOW 3 24 56 Left 1
SYMATTR InstName C_cavo_sonda6
SYMATTR Value 30p
SYMBOL cap -1376 640 R0
WINDOW 0 24 8 Left 1
WINDOW 3 24 56 Left 1
SYMATTR InstName C_osc6
SYMATTR Value 20p
SYMBOL res -1296 544 R0
WINDOW 0 36 40 Left 1
WINDOW 3 36 76 Left 1
SYMATTR InstName R_osc6
SYMATTR Value 1Meg
SYMBOL cap -2256 368 M180
WINDOW 0 24 56 Left 1
WINDOW 3 24 8 Left 1
SYMATTR InstName C_cavo3
SYMATTR Value 106.4p
SYMBOL res -2112 272 R0
WINDOW 0 36 40 Left 1
WINDOW 3 36 76 Left 1
SYMATTR InstName Rsh5
SYMATTR Value 147.92k
SYMBOL cap -2160 128 R90
WINDOW 0 0 32 VBottom 1
WINDOW 3 32 32 VTop 1
SYMATTR InstName Csh5
SYMATTR Value 68p
SYMBOL res -1808 112 R90
WINDOW 0 0 56 VBottom 1
WINDOW 3 32 56 VTop 1
SYMATTR InstName Rsh6
SYMATTR Value 148.02k
SYMBOL cap -1792 176 R0
WINDOW 3 24 56 Left 1
SYMATTR Value 68p
SYMATTR InstName Csh6
TEXT -336 456 Left 2 !.tran 80m
TEXT -560 -56 Left 2 ;CH-1
TEXT 832 272 Left 2 ;CH-2
TEXT -216 -168 Left 2 ;Calibrazione sonde esatta
TEXT 1584 -72 Left 2 ;.tran 20m
TEXT 1360 -584 Left 2 ;CH-1
TEXT 2752 -256 Left 2 ;CH-2
TEXT 1624 -688 Left 2 ;Calibrazione errata:C sovrastimata
TEXT 1632 328 Left 2 ;Calibrazione errata:C sottostimata
TEXT 1536 968 Left 2 ;.tran 20m
TEXT 1312 456 Left 2 ;CH-1
TEXT 2704 784 Left 2 ;CH-2
TEXT -2464 -472 Left 2 ;.tran 20u
TEXT -2688 -984 Left 2 ;CH-1
TEXT -1296 -656 Left 2 ;CH-2
TEXT -2368 568 Left 2 ;.tran 20u
TEXT -2592 56 Left 2 ;CH-1
TEXT -1200 384 Left 2 ;CH-2

The netlist it stands for:
* Shaper_Basic.asc
X§U1 N025 N020 N019 N032 N020 ADTL082  ; pins In+ In- V+ V- OUT
V1 N019 0 15.02
V2 0 N032 15.02
C1 N019 0 0.1µ
C2 0 N032 0.1µ
V3 N031 0 SINE(0 1 800k)
Rg N022 N031 50
R_sonda1 N022 N021 9Meg
C_sonda1 N022 N021 5.56p
R_osc1 N021 0 1Meg
C_osc1 N021 0 20p
C_cavo_sonda1 N021 0 30p
R_sonda2 N033 N024 9Meg
C_sonda2 N033 N024 5.56p
C_cavo_sonda2 N033 0 30p
C_osc2 N033 0 20p
R_osc2 N033 0 1Meg
C_cavo1 0 N022 106.4p
Rsh1 N025 0 147.92k
Csh1 N025 N022 68p
Rsh2 N024 N020 148.02k
Csh2 N024 0 68p
X§U4 N015 N011 N010 N017 N011 ADTL082  ; pins In+ In- V+ V- OUT
V10 N010 0 15.02
V11 0 N017 15.02
C7 N010 0 0.1µ
C8 0 N017 0.1µ
V12 N016 0 PULSE(0 1 0 1u 1u 5m 10m)
Rg3 N013 N016 50
R_sonda7 N013 N012 9Meg
C_sonda7 N013 N012 5.605p
R_osc7 N012 0 1Meg
C_osc7 N012 0 20p
C_cavo_sonda7 N012 0 30p
R_sonda8 N018 N014 9Meg
C_sonda8 N018 N014 5.605p
C_cavo_sonda8 N018 0 30p
C_osc8 N018 0 20p
R_osc8 N018 0 1Meg
C_cavo4 0 N013 106.4p
Rsh7 N015 0 147.92k
Csh7 N015 N013 67p
Rsh8 N014 N011 148.02k
Csh8 N014 0 67p
X§U5 N042 N038 N037 N044 N038 ADTL082  ; pins In+ In- V+ V- OUT
V13 N037 0 15.02
V14 0 N044 15.02
C9 N037 0 0.1µ
C10 0 N044 0.1µ
V15 N043 0 PULSE(0 1 0 1u 1u 5m 10m)
Rg4 N040 N043 50
R_sonda9 N040 N039 9Meg
C_sonda9 N040 N039 5.506p
R_osc9 N039 0 1Meg
C_osc9 N039 0 20p
C_cavo_sonda9 N039 0 30p
R_sonda10 N045 N041 9Meg
C_sonda10 N045 N041 5.506p
C_cavo_sonda10 N045 0 30p
C_osc10 N045 0 20p
R_osc10 N045 0 1Meg
C_cavo5 0 N040 106.4p
Rsh9 N042 0 147.92k
Csh9 N042 N040 67p
Rsh10 N041 N038 148.02k
Csh10 N041 0 67p
X§U2 N006 N002 N001 N008 N002 ADTL082  ; pins In+ In- V+ V- OUT
V4 N001 0 15.02
V5 0 N008 15.02
C3 N001 0 0.1µ
C4 0 N008 0.1µ
V6 N007 0 PULSE(0 2 0 1u 1u 10m 20m)
Rg1 N004 N007 50
R_sonda3 N004 N003 9Meg
C_sonda3 N004 N003 6.06p
R_osc3 N003 0 1Meg
C_osc3 N003 0 20p
C_cavo_sonda3 N003 0 30p
R_sonda4 N009 N005 9Meg
C_sonda4 N009 N005 6.06p
C_cavo_sonda4 N009 0 30p
C_osc4 N009 0 20p
R_osc4 N009 0 1Meg
C_cavo2 0 N004 106.4p
Rsh3 N006 0 147.92k
Csh3 N006 N004 68p
Rsh4 N005 N002 148.02k
Csh4 N005 0 68p
X§U3 N030 N026 N023 N035 N026 ADTL082  ; pins In+ In- V+ V- OUT
V7 N023 0 15.02
V8 0 N035 15.02
C5 N023 0 0.1µ
C6 0 N035 0.1µ
V9 N034 0 PULSE(0 2 0 1u 1u 10m 20m)
Rg2 N028 N034 50
R_sonda5 N028 N027 9Meg
C_sonda5 N028 N027 5.56p
R_osc5 N027 0 1Meg
C_osc5 N027 0 20p
C_cavo_sonda5 N027 0 30p
R_sonda6 N036 N029 9Meg
C_sonda6 N036 N029 5.56p
C_cavo_sonda6 N036 0 30p
C_osc6 N036 0 20p
R_osc6 N036 0 1Meg
C_cavo3 0 N028 106.4p
Rsh5 N030 0 147.92k
Csh5 N030 N028 68p
Rsh6 N029 N026 148.02k
Csh6 N029 0 68p
.tran 80m
* CH-1
* CH-2
* Calibrazione sonde esatta
* .tran 20m
* CH-1
* CH-2
* Calibrazione errata:C sovrastimata
* Calibrazione errata:C sottostimata
* .tran 20m
* CH-1
* CH-2
* .tran 20u
* CH-1
* CH-2
* .tran 20u
* CH-1
* CH-2
.lib ADI.lib
.backanno
.end